# Altium schematic sheet microcontroller.SchDoc
size A4; Author: Mikołaj Pichita; CompanyName: AGH University of Science and Technology; SheetNumber: 11; SheetTotal: 16
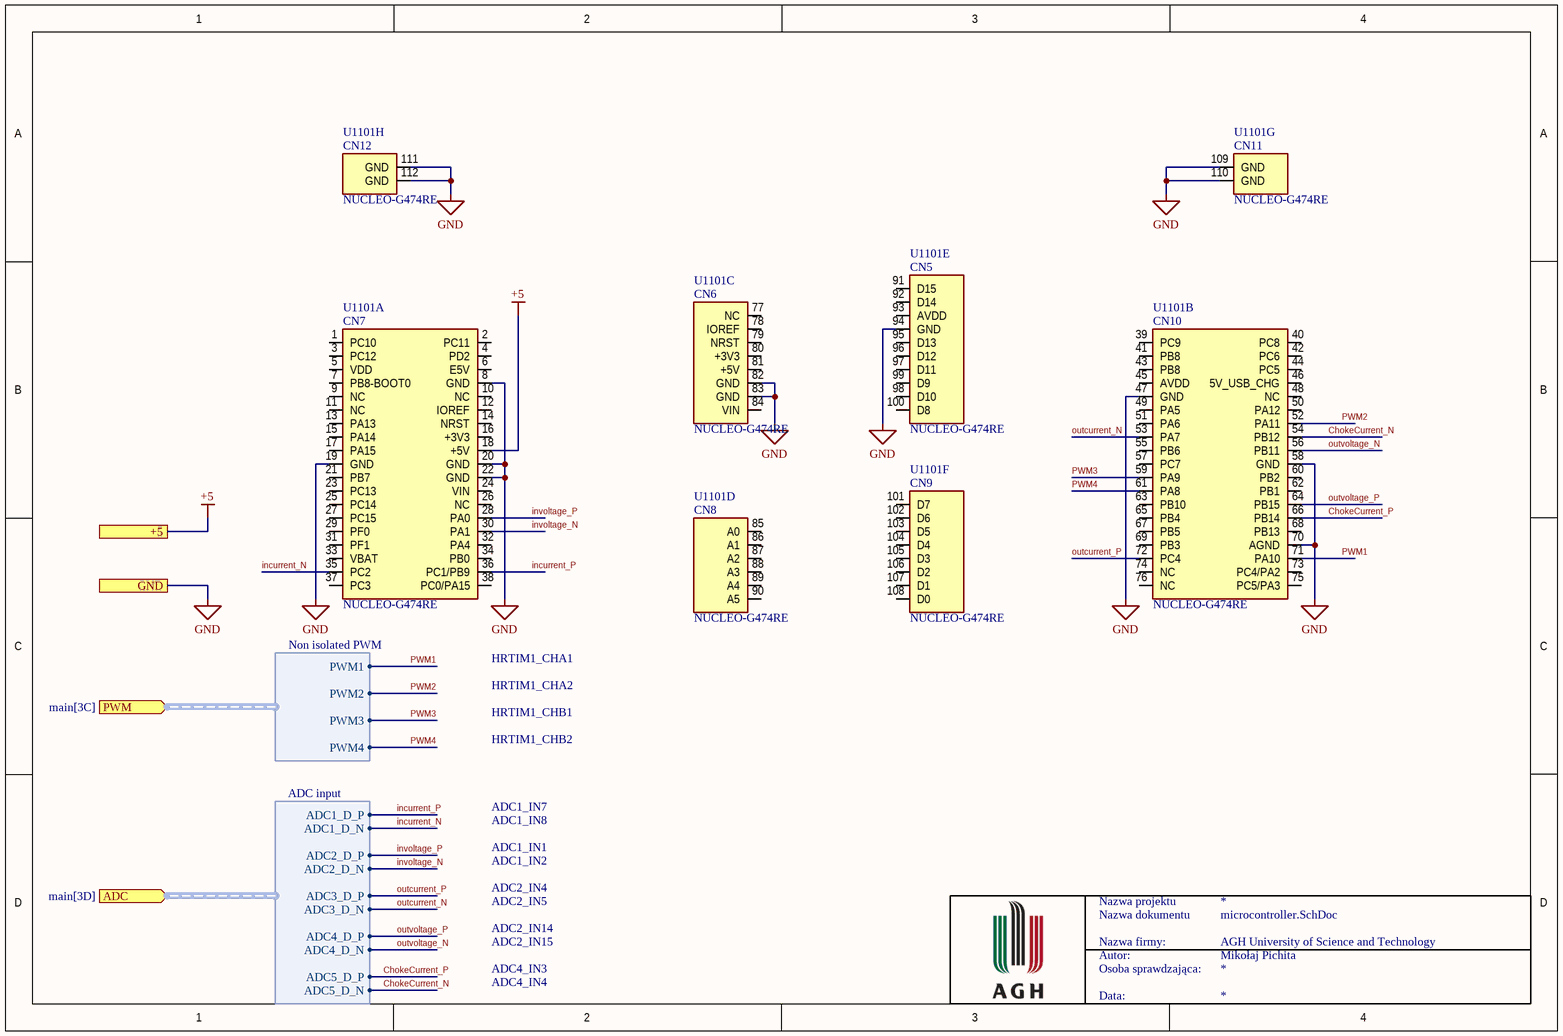
[diagram p0: microcontroller.SchDoc]

## Parts
U1101  NUCLEO-G474RE  [G474RE]  (parts A,B,C,D,E,F,G,H of 8)

## Ports
+5 (see main[2D], choke_current_meas[4B], current_sense_shunt[4A], full_bridge[1C], isolator[1B], measurements[1C], power_supply[2B], voltage_sense[4A]), ADC (in, harness ADC input, see main[3D]), GND (see main[2D], choke_current_meas[4B], current_sense_shunt[4A], full_bridge[1D], isolator[1B], measurements[1C], power_supply[1B], voltage_sense[4A]), PWM (in, harness Non isolated PWM, see main[3C])

## Harnesses
Non isolated PWM: PWM1, PWM2, PWM3, PWM4
ADC input: ADC5_D_P, ADC1_D_N, ADC2_D_N, ADC3_D_N, ADC4_D_N, ADC1_D_P, ADC2_D_P, ADC3_D_P, ADC4_D_P, ADC5_D_N

## Nets
+5: U1101.18(+5V) ; port +5
GND: U1101.8(GND) U1101.19(GND) U1101.20(GND) U1101.22(GND) U1101.47(GND) U1101.58(GND) U1101.70(AGND) U1101.82(GND) U1101.83(GND) U1101.94(GND) U1101.109(GND) U1101.110(GND) U1101.111(GND) U1101.112(GND) ; port GND
ChokeCurrent_N: U1101.54(PB12) ; port ADC.ADC5_D_N
ChokeCurrent_P: U1101.66(PB14) ; port ADC.ADC5_D_P
incurrent_N: U1101.35(PC2) ; port ADC.ADC1_D_N
incurrent_P: U1101.36(PC1/PB9) ; port ADC.ADC1_D_P
involtage_N: U1101.30(PA1) ; port ADC.ADC2_D_N
involtage_P: U1101.28(PA0) ; port ADC.ADC2_D_P
outcurrent_N: U1101.53(PA7) ; port ADC.ADC3_D_N
outcurrent_P: U1101.72(PC4) ; port ADC.ADC3_D_P
outvoltage_N: U1101.56(PB11) ; port ADC.ADC4_D_N
outvoltage_P: U1101.64(PB15) ; port ADC.ADC4_D_P
PWM1: U1101.71(PA10) ; port PWM.PWM1
PWM2: U1101.52(PA11) ; port PWM.PWM2
PWM3: U1101.59(PA9) ; port PWM.PWM3
PWM4: U1101.61(PA8) ; port PWM.PWM4

Not connected (* = marked no-connect by the designer): U1101 1(PC10) 2(PC11) 3(PC12) 4(PD2) 5(VDD) 6(E5V) 7(PB8-BOOT0) 9(NC) 10(NC) 11(NC) 12(IOREF) 13(PA13) 14(NRST) 15(PA14) 16(+3V3) 17(PA15) 21(PB7) 23(PC13) 24(VIN) 25(PC14) 26(NC) 27(PC15) 29(PF0) 31(PF1) 32(PA4) 33(VBAT) 34(PB0) 37(PC3) 38(PC0/PA15) 39(PC9) 40(PC8) 41(PB8) 42(PC6) 43(PB8) 44(PC5) 45(AVDD) 46(5V_USB_CHG) 48(NC) 49(PA5) 50(PA12) 51(PA6) 55(PB6) 57(PC7) 60(PB2) 62(PB1) 63(PB10) 65(PB4) 67(PB5) 68(PB13) 69(PB3) 73(PC4/PA2) 74(NC) 75(PC5/PA3) 76(NC) 77(NC) 78(IOREF) 79(NRST) 80(+3V3) 81(+5V) 84(VIN) 85(A0) 86(A1) 87(A2) 88(A3) 89(A4) 90(A5) 91(D15) 92(D14) 93(AVDD) 95(D13) 96(D12) 97(D11) 98(D10) 99(D9) 100(D8) 101(D7) 102(D6) 103(D5) 104(D4) 105(D3) 106(D2) 107(D1) 108(D0)

## Notes on the sheet
- HRTIM1_CHA1
- HRTIM1_CHA2
- HRTIM1_CHB1
- HRTIM1_CHB2
- ADC1_IN1
- ADC1_IN7
- ADC1_IN8
- ADC1_IN2
- ADC2_IN5
- ADC2_IN4
- ADC2_IN14
- ADC2_IN15
- ADC4_IN3
- ADC4_IN4
- Nazwa projektu
- Nazwa dokumentu
- Nazwa firmy:
- Autor:
- Osoba sprawdzająca:
- Data:
- (in symbol NUCLEO-G474RE, part A) CN7
- (in symbol NUCLEO-G474RE, part B) CN10
- (in symbol NUCLEO-G474RE, part C) CN6
- (in symbol NUCLEO-G474RE, part D) CN8
- (in symbol NUCLEO-G474RE, part E) CN5
- (in symbol NUCLEO-G474RE, part F) CN9
- (in symbol NUCLEO-G474RE, part G) CN11
- (in symbol NUCLEO-G474RE, part H) CN12

## Library data of the parts
U1101 = NUCLEO-G474RE: STM32 Nucleo-64 development board with STM32G474RE MCU, supports Arduino and ST morpho connectivity; Value: *; HelpURL: *; MPN: *; Supplier: *; SupplierPartNumber: *